# EAGLE design control_rev4 (EAGLE 5.06)
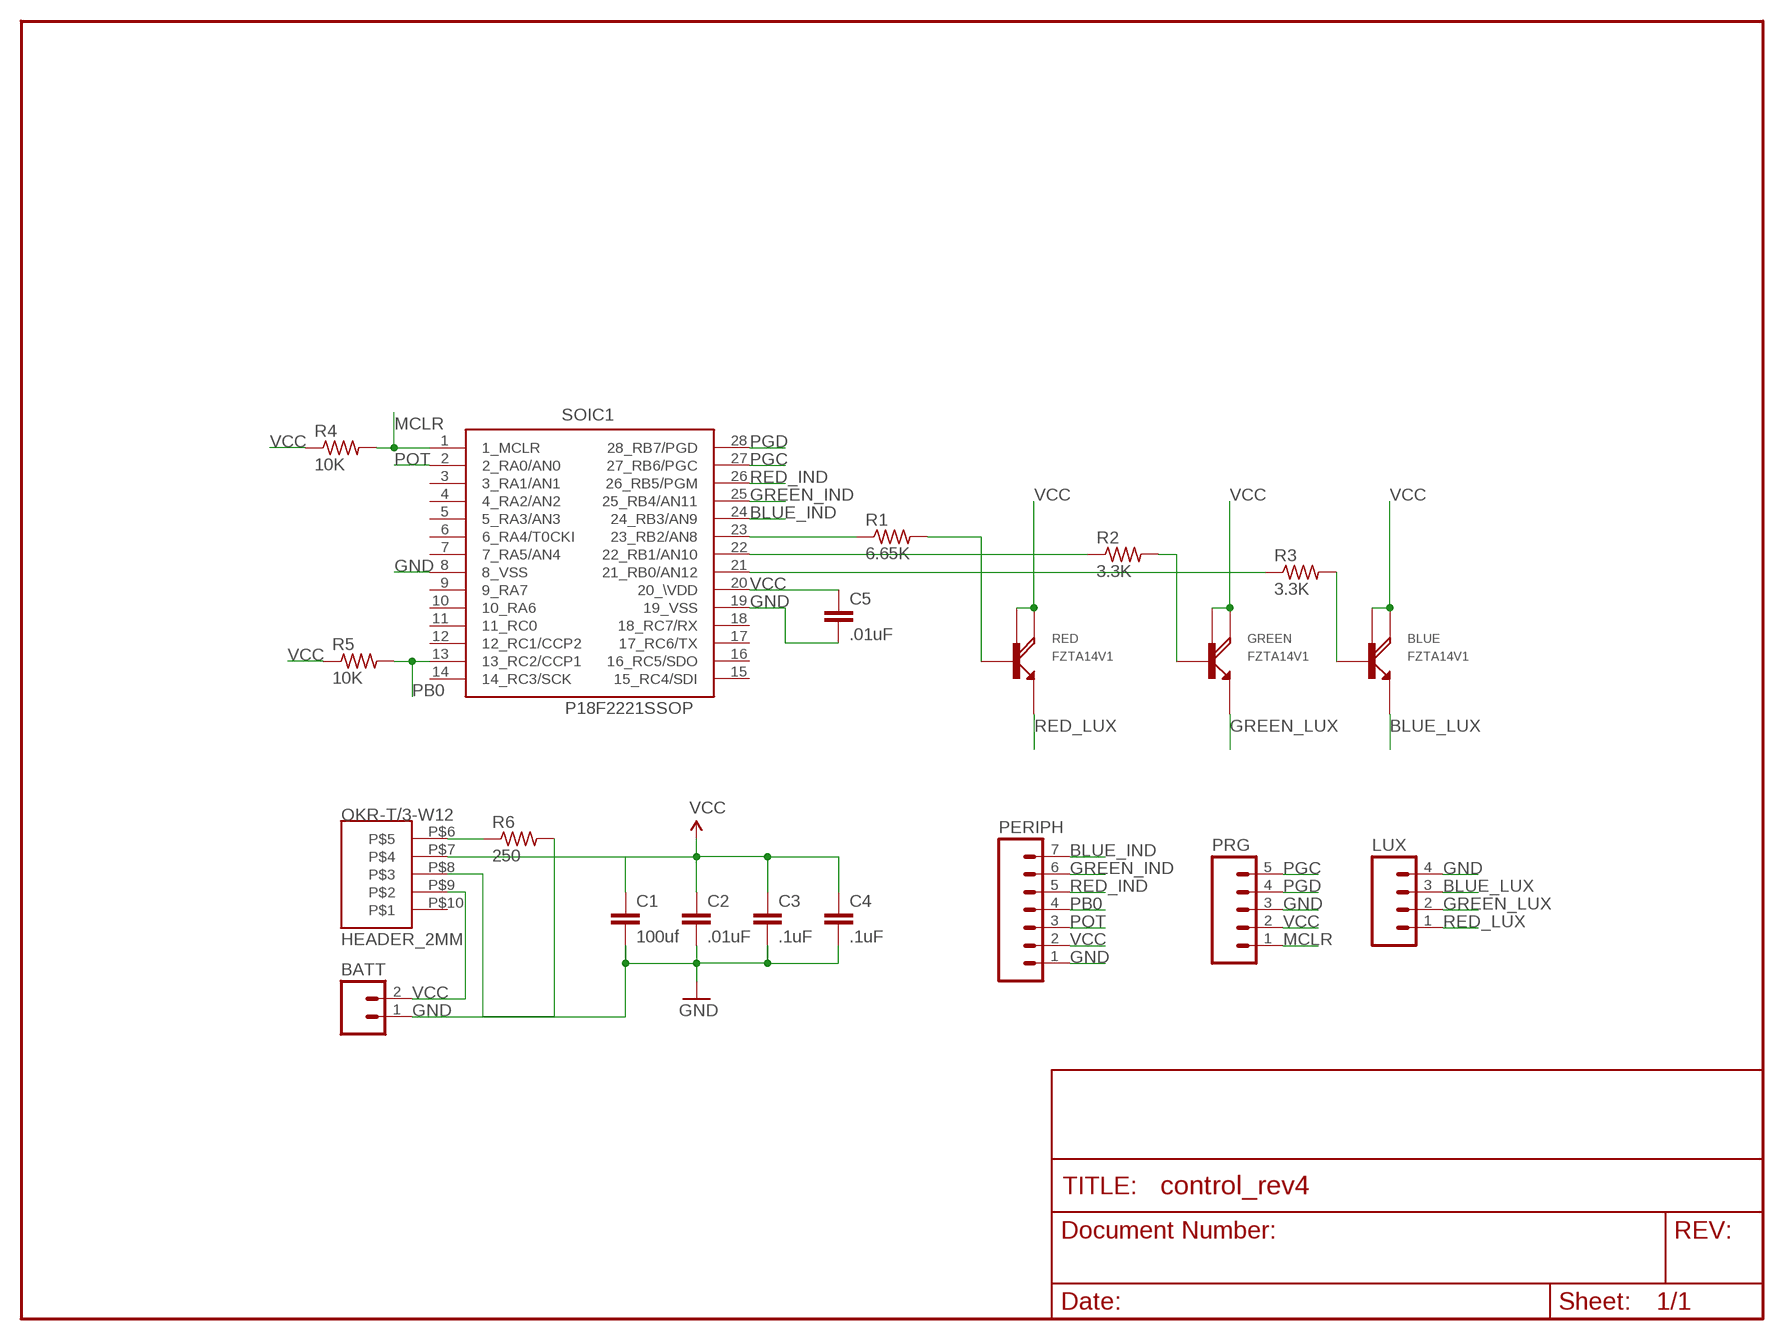
[diagram p0: schematic, sheet 1]

## Parts
BATT  M02PTH  [1X02]
BLUE  FZTA14V1  [SOT223]
C1  100uf  C5/7.2  [C5B7.2]
C2  .01uF  CAP0805  [0805]
C3  .1uF  CAP0805  [0805]
C4  .1uF  CAP0805  [0805]
C5  .01uF  CAP0805  [0805]
GREEN  FZTA14V1  [SOT223]
LUX  M04PTH  [1X04]
OKR-T/3-W12  HEADER_2MM  [HEADER2MM_5]
PERIPH  M07  [1X07]
PRG  M05PTH  [1X05]
R1  6.65K  R-US_M1206  [M1206]
R2  3.3K  R-US_M1206  [M1206]
R3  3.3K  R-US_M1206  [M1206]
R4  10K  R-US_M1206  [M1206]
R5  10K  R-US_M1206  [M1206]
R6  250  R-US_M1206  [M1206]
RED  FZTA14V1  [SOT223]
SOIC1  P18F2221SSOP  [SSOP-28]

## Nets
BLUE_IND: PERIPH.7 SOIC1.24(24_RB3/AN9)
BLUE_LUX: BLUE.EMIT(E) LUX.3
GND: BATT.1 C1.2 C2.2 C3.2 C4.2 C5.2 LUX.4 OKR-T/3-W12.P$8 PERIPH.1 PRG.3 R6.2 SOIC1.8(8_VSS) SOIC1.19(19_VSS)
GREEN_IND: PERIPH.6 SOIC1.25(25_RB4/AN11)
GREEN_LUX: GREEN.EMIT(E) LUX.2
MCLR: PRG.1 R4.2 SOIC1.1(1_MCLR)
N$4: R1.1 SOIC1.23(23_RB2/AN8)
N$5: R1.2 RED.BASE(B)
N$6: R2.1 SOIC1.22(22_RB1/AN10)
N$7: GREEN.BASE(B) R2.2
N$8: R3.1 SOIC1.21(21_RB0/AN12)
N$9: BLUE.BASE(B) R3.2
N$19: OKR-T/3-W12.P$6 R6.1
PB0: PERIPH.4 R5.2 SOIC1.13(13_RC2/CCP1)
PGC: PRG.5 SOIC1.27(27_RB6/PGC)
PGD: PRG.4 SOIC1.28(28_RB7/PGD)
POT: PERIPH.3 SOIC1.2(2_RA0/AN0)
PWR: BATT.2 OKR-T/3-W12.P$9
RED_IND: PERIPH.5 SOIC1.26(26_RB5/PGM)
RED_LUX: LUX.1 RED.EMIT(E)
VCC: BLUE.COLL(C) BLUE.HEAT(C2) C1.1 C2.1 C3.1 C4.1 C5.1 GREEN.COLL(C) GREEN.HEAT(C2) OKR-T/3-W12.P$7 PERIPH.2 PRG.2 R4.1 R5.1 RED.COLL(C) RED.HEAT(C2) SOIC1.20(20_\VDD)
Unconnected: OKR-T/3-W12.P$10 SOIC1.3(3_RA1/AN1) SOIC1.4(4_RA2/AN2) SOIC1.5(5_RA3/AN3) SOIC1.6(6_RA4/T0CKI) SOIC1.7(7_RA5/AN4) SOIC1.9(9_RA7) SOIC1.10(10_RA6) SOIC1.11(11_RC0) SOIC1.12(12_RC1/CCP2) SOIC1.14(14_RC3/SCK) SOIC1.15(15_RC4/SDI) SOIC1.16(16_RC5/SDO) SOIC1.17(17_RC6/TX) SOIC1.18(18_RC7/RX)

## Library data of the parts
BATT = SparkFun:M02: Header 2 Standard 2-pin 0.1" header. Use with straight break away headers (SKU : PRT-00116), right angle break away headers (PRT-00553), swiss pins (PRT-00743), machine pins (PRT-00117), and female headers (PRT-00115). Molex polarized connector foot print use with SKU : PRT-08233 with associated crimp pins and housings.
BLUE GREEN RED = purduecer:FZTA14: NPN Darlington Transistor
C1 = capacitor-wima:C: CAPACITOR naming: grid - package width
C2-C5 = SparkFun:CAP: Capacitor Standard 0603 ceramic capacitor, and 0.1" leaded capacitor.
LUX = SparkFun:M04: Header 4 Standard 4-pin 0.1" header. Use with straight break away headers (SKU : PRT-00116), right angle break away headers (PRT-00553), swiss pins (PRT-00743), machine pins (PRT-00117), and female headers (PRT-00115). Molex polarized connector foot print use with SKU : PRT-08231 with associated crimp pins and housings.
OKR-T/3-W12 = NBitWonder:HEADER_2MM: 5-pin Header w/ 2mm (NOT 2.54mm!) spacing
PERIPH = SparkFun:M07: Header 7 Standard 7-pin 0.1" header. Use with straight break away headers (SKU : PRT-00116), right angle break away headers (PRT-00553), swiss pins (PRT-00743), machine pins (PRT-00117), and female headers (PRT-00115). NOTES ON THE VARIANTS LOCK and LOCK_LONGPADS... This footprint was designed to help hold the alignment of a through-hole component (i.e. 7-pin header) while soldering it into place. You may notice that each hole has been shifted either up or down by 0.005 of an inch from it's more standard position (which is usually a perfectly straight line). This slight alteration caused the pins (the squares in the middle) to touch the edges of the holes. Because they are alternating, it causes a "brace" to hold the header in place. 0.005 has proven to be the perfect amount of "off-center" position when using our standard breakaway headers. Although looks a little odd when you look at the bare footprint, once you have a header in there, the alteration is very hard to notice. Also, if you push a header all the way into place, it is covered up entirely on the bottom side. This idea of altering the position of holes to aid alignment will be further integrated into the Sparkfun Library for other footprints. It can help hold any component with 3 or more connection pins.
PRG = SparkFun:M05: Header 5 Standard 5-pin 0.1" header. Use with straight break away headers (SKU : PRT-00116), right angle break away headers (PRT-00553), swiss pins (PRT-00743), machine pins (PRT-00117), and female headers (PRT-00115). Molex polarized connector foot print use with SKU : PRT-08230 with associated crimp pins and housings.
R1-R6 = resistor:R-US_: RESISTOR, American symbol
SOIC1 = purduecer:P18F2221: 28-pin PIC18F series Microcontroller

## Board
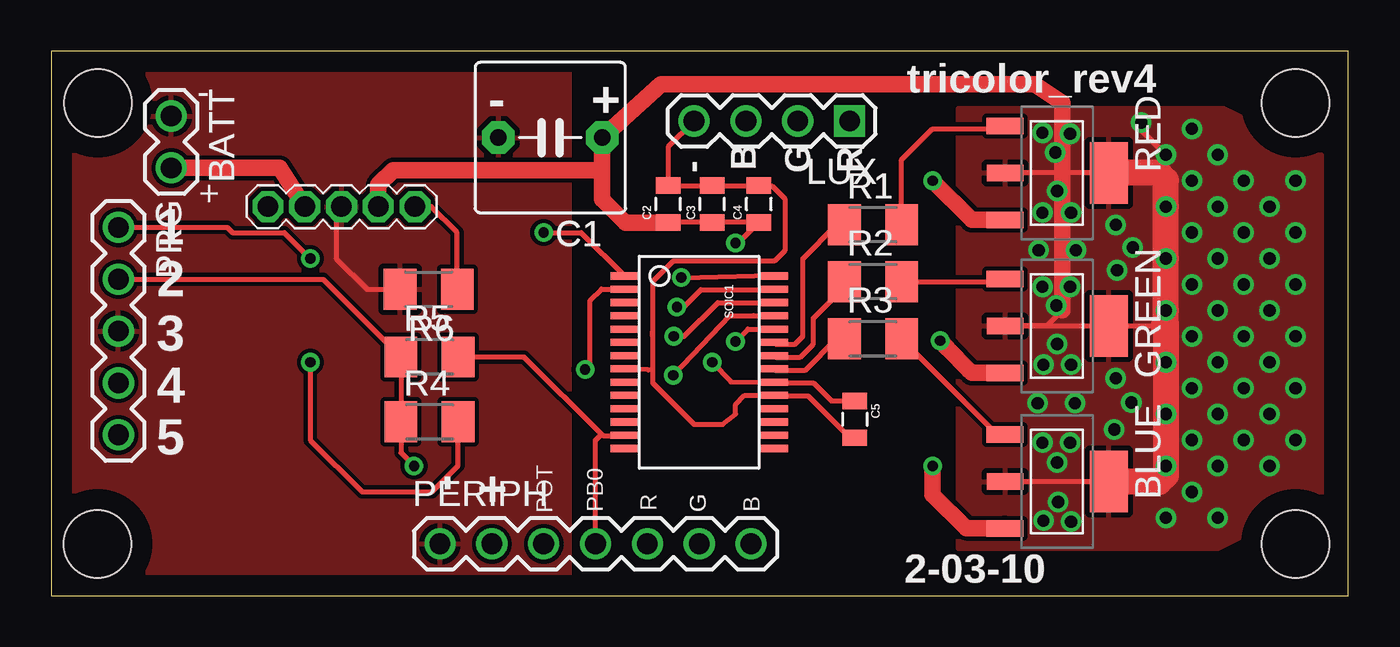
[diagram p1: board, top side]
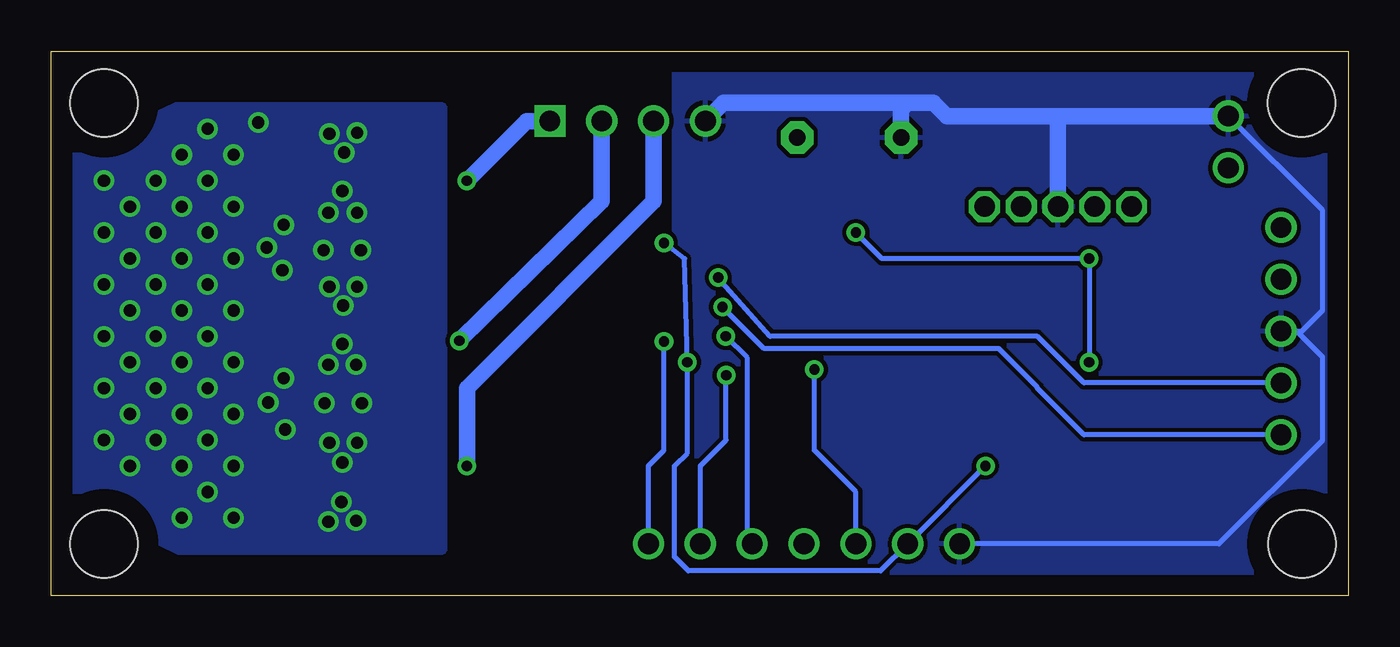
[diagram p2: board, bottom side, seen from below]

Size 63.55 x 26.67 mm. Coordinates in mm from the lower left corner, seen from the top.
Outline: 0,0 63.55,0 63.55,26.66 0,26.67 0,0
Copper layers (1*16): Top 0.035mm / dielectric 1.5mm / Bottom 0.035mm
Design rules "default": minimum track width 10mil, minimum drill 24mil, track to track 8mil, track to pad 8mil, pad to pad 8mil, via to via 8mil, smd to smd 8mil, copper to edge 40mil, drill to drill 8mil, minimum pad ring 10mil, minimum via ring 8mil, stop-mask expansion 4mil, vias tented up to drill 0mil, thermal gap 10mil

### Footprints (pad centres in the part's own frame; a part is rotated, then mirrored left to right if it is on the bottom)
1X02 = drill 1.016 round: 1 0,0; 2 2.54,0
SOT223 = smd 0.8 x 1.8: BASE -2.3,-2.55; COLL 0,-2.54; EMIT 2.3,-2.55 | smd 3 x 1.85: HEAT 0,2.54
C5B7.2 = drill 0.813 pad 1.6 octagon: 1 -2.54,0; 2 2.54,0
0805 = smd 0.8 x 1.2: 1 -0.9,0; 2 0.9,0
1X04 = drill 1.016 square: 1 0,0 | drill 1.016 round: 2 2.54,0; 3 5.08,0; 4 7.62,0
HEADER2MM_5 = drill 1 octagon: P$6 0,0; P$7 1.8,0; P$8 3.6,0; P$9 5.4,0; P$10 7.2,0
1X07 = drill 1.016 round: 1 0,0; 2 2.54,0; 3 5.08,0; 4 7.62,0; 5 10.16,0; 6 12.7,0; 7 15.24,0
1X05 = drill 1.016 round: 1 0,0; 2 2.54,0; 3 5.08,0; 4 7.62,0; 5 10.16,0
M1206 = smd 1.6 x 2: 1 -1.4,0; 2 1.4,0
SSOP-28 = smd 0.348 x 1.397: 1 -4.225,-3.656; 2 -3.575,-3.656; 3 -2.925,-3.656; 4 -2.275,-3.656; 5 -1.625,-3.656; 6 -0.975,-3.656; 7 -0.325,-3.656; 8 0.325,-3.656; 9 0.975,-3.656; 10 1.625,-3.656; 11 2.275,-3.656; 12 2.925,-3.656; 13 3.575,-3.656; 14 4.225,-3.656; 15 4.225,3.656; 16 3.575,3.656; 17 2.925,3.656; 18 2.275,3.656; 19 1.625,3.656; 20 0.975,3.656; 21 0.325,3.656; 22 -0.325,3.656; 23 -0.975,3.656; 24 -1.625,3.656; 25 -2.275,3.656; 26 -2.925,3.656; 27 -3.575,3.656; 28 -4.225,3.656
STAND-OFF = hole 3.302: 0,0

### Placement (x,y rotation side)
BATT  5.89,23.49 270 top
BLUE  49.28,5.59 270 top
C1  24.46,22.43 180 top
C2  30.23,19.18 90 top
C3  32.38,19.18 90 top
C4  34.67,19.18 90 top
C5  39.37,8.64 270 top
GREEN  49.28,13.21 270 top
LUX  39.12,23.24 180 top
OKR-T/3-W12  17.83,19.05 180 top
PERIPH  19.05,2.54 0 top
PRG  3.3,18.04 270 top
R1  40.26,18.16 0 top
R2  40.26,15.37 0 top
R3  40.26,12.57 0 top
R4  18.54,8.51 0 top
R5  18.54,11.68 0 top
R6  18.49,15 180 top
RED  49.28,20.7 270 top
SOIC1  31.75,11.43 270 top
U$1  [STAND-OFF]  2.29,2.54 0 top
U$2  [STAND-OFF]  2.29,24.13 0 top
U$3  [STAND-OFF]  60.96,24.13 0 top
U$4  [STAND-OFF]  60.96,2.54 0 top

### Tracks (layer width: path | path; a pad name or v marks a point on that pad's centre or on a via)
BLUE_IND  (via drill 0.51)
  Top 0.254: SOIC1.24 34.14,13.06 v33.53,12.45
  Bottom 0.254: v33.53,12.45 33.53,7.11 34.29,6.35 PERIPH.7
BLUE_LUX  (via drill 0.51)
  Top 0.813: v43.18,6.35 43.18,4.95 44.83,3.3 46.71,3.3 BLUE.EMIT
  Bottom 0.813: LUX.3 34.04,19.3 43.18,10.16 v43.18,6.35
GND
  Top 0.254: LUX.4 30.23,21.97 C2.2 C3.2 C4.2 34.68,20.07 35.31,20.07 35.94,19.43 35.94,16.89 35.43,16.38 31.11,16.38 31.11,16.39 30.47,16.39 29.46,15.38 29.46,12.7 | C5.2 39.13,7.74 37.08,9.78 35.43,9.78 SOIC1.19 33.98,9.81 33.53,9.36 33.53,8.89 32.89,8.38 31.5,8.38 29.46,10.41 29.46,11.05 | 29.46,11.05 29.25,11.06 SOIC1.8 | 29.46,12.7 29.46,11.05 | 29.46,12.7 29.46,12.96 | R6.2 15.48,15 13.97,16.51 13.97,18.91 OKR-T/3-W12.P$8
  Bottom 0.254: 2.54,12.96 2.29,12.96 1.27,13.97 1.27,18.87 BATT.1 | 2.54,12.96 PRG.3 | PERIPH.1 6.35,2.54 1.27,7.62 1.27,11.68 2.54,12.96
  Bottom 0.813: BATT.1 13.97,23.49 | 13.97,23.49 19.68,23.49 20.32,24.13 21.59,24.13 | 21.59,24.13 30.61,24.13 LUX.4 | C1.2 21.92,23.8 21.59,24.13 | OKR-T/3-W12.P$8 14.23,23.23 13.97,23.49
  pour Bottom: 33.02,0 33.02,26.67 0,26.67 0,0
  pour Top: 25.4,0 25.4,26.67 0,26.67 0,0
GREEN_IND  (via drill 0.51)
  Top 0.254: v30.48,10.8 33.26,13.7 34.42,13.72 SOIC1.25
  Bottom 0.254: v30.48,10.8 30.48,7.62 31.75,6.35 PERIPH.6
GREEN_LUX  (via drill 0.51)
  Top 0.813: v43.56,12.48 43.94,12.1 44.96,11.05 45.1,10.91 GREEN.EMIT
  Bottom 0.813: LUX.2 36.58,19.3 v43.56,12.48
MCLR  (via drill 0.5)
  Top 0.254: 28.08,15.66 27.94,15.66 27.95,15.66 SOIC1.1 25.97,17.78 v24.13,17.78 | PRG.1 8.64,18.04 8.89,17.78 11.43,17.78 v12.7,16.51 | v12.7,11.43 12.7,7.62 15.24,5.08 18.66,5.08 19.94,6.36 R4.2
  Bottom 0.254: v24.13,17.78 22.86,16.51 v12.7,16.51 v12.7,11.43
N$4
  Top 0.254: R1.1 38.48,18.16 36.83,16.51 36.83,12.7 36.45,12.32 35.49,12.32 SOIC1.23
N$5
  Top 0.254: R1.2 41.66,21.34 43.18,22.86 46.59,22.86 RED.BASE
N$6
  Top 0.254: R2.1 38.86,15.11 37.34,13.59 37.34,12.32 36.7,11.68 35.48,11.68 SOIC1.22
N$7
  Top 0.254: R2.2 46.59,15.37 GREEN.BASE
N$8
  Top 0.254: R3.1 38.48,12.57 36.96,11.05 35.46,11.05 SOIC1.21
N$9
  Top 0.254: BLUE.BASE 46.34,7.89 R3.2
N$19
  Top 0.254: OKR-T/3-W12.P$6 18.62,19.05 19.88,17.79 19.88,15.02 R6.1
PB0
  Top 0.254: R5.2 23.18,11.68 26.95,7.91 | 26.95,7.91 27.03,7.83 28.07,7.83 SOIC1.13 | PERIPH.4 26.67,7.62 26.95,7.91
PGC  (via drill 0.5)
  Top 0.254: v30.66,14.14 30.98,14.14 31.83,14.99 35.39,14.99 SOIC1.27
  Bottom 0.254: PRG.5 12.95,7.88 15.24,10.16 15.24,10.21 17.13,12.1 28.62,12.1 v30.66,14.14
PGD  (via drill 0.5)
  Top 0.254: v30.87,15.58 35.37,15.69 SOIC1.28
  Bottom 0.254: PRG.4 12.95,10.41 15.24,12.7 28.33,12.7 v30.87,15.58
POT  (via drill 0.5)
  Top 0.254: SOIC1.2 26.95,15.01 26.41,14.46 26.41,11.33 v26.16,11.08
  Bottom 0.254: v26.16,11.08 26.16,7.12 24.13,5.08 PERIPH.3
PWR
  Top 0.813: BATT.2 11.2,20.95 OKR-T/3-W12.P$9
RED_IND  (via drill 0.51)
  Top 0.254: SOIC1.26 32.66,14.36 30.99,12.69 30.52,12.69 v30.5,12.71
  Bottom 0.254: v30.5,12.71 | v30.5,12.71 29.45,11.65 29.45,2.78 PERIPH.5
RED_LUX  (via drill 0.51)
  Top 0.813: RED.EMIT 45.1,18.4 v43.18,20.32
  Bottom 0.813: v43.18,20.32 40.27,23.23 39.13,23.23 LUX.1
VCC  (via drill 0.5, 0.51, 0.6)
  Top 0.254: GREEN.COLL GREEN.HEAT | BLUE.HEAT BLUE.COLL | C5.1 38.22,9.54 37.34,10.41 35.45,10.41 SOIC1.20 33.3,10.47 v32.38,11.43 | RED.HEAT RED.COLL | GREEN.COLL 54.5,13.21 | PRG.2 13.33,15.49 R5.1 R4.1 17.14,6.99 v17.78,6.35 | C2.1 C3.1 C4.1 33.67,17.27 v33.53,17.27 | GREEN.COLL 48.77,13.21 49.53,13.97 | v53.4,23.17 53.4,22.8 v54.61,21.59
  Top 0.813: 49.53,13.97 49.53,24.13 48.17,25.05 29.88,25.05 C1.1 27,20.82 | 27,20.82 27,19.4 28.13,18.27 30.21,18.27 C2.1 | OKR-T/3-W12.P$7 16.03,20.11 16.76,20.84 26.98,20.84 27,20.82
  Top 1.27: RED.HEAT 54.23,20.7 54.61,20.32 v54.61,19.05 v54.61,16.51 v54.61,13.97 54.61,13.32 | 54.61,13.32 v54.61,11.43 v54.61,8.89 v54.61,6.35 54.61,5.91 54.27,5.57 51.83,5.57 BLUE.HEAT | 54.5,13.21 54.61,13.32
  Bottom 0.254: v33.53,17.27 32.51,16.51 v32.38,11.43 32.38,6.99 33.02,6.35 33.02,1.9 32.33,1.22 22.91,1.22 PERIPH.2 v17.78,6.35
  other vias: 54.61,3.81 57.15,3.81 55.88,5.08 57.15,6.35 55.88,7.62 59.69,6.35 58.42,7.62 60.96,7.62 59.69,8.89 57.15,8.89 55.88,10.16 58.42,10.16 60.96,10.16 59.69,11.43 57.15,11.43 55.88,12.7 58.42,12.7 60.96,12.7 59.69,13.97 57.15,13.97 55.88,15.24 58.42,15.24 60.96,15.24 59.69,16.51 57.15,16.51 55.88,17.78 60.96,17.78 58.42,17.78 57.15,19.05 55.88,20.32 59.69,19.05 58.42,20.32 60.96,20.32 57.15,21.59 55.88,22.86 48.61,3.67 49.96,3.63 49.33,4.59 49.29,6.53 48.56,7.49 49.91,7.49 52.08,8.14 52.92,9.46 52.15,10.65 50.15,9.42 48.32,9.42 49.96,11.31 48.61,11.31 49.29,12.32 49.24,14.21 48.56,15.13 49.91,15.13 50.2,16.92 48.37,16.92 52.22,15.93 52.98,17.05 52.15,18.16 49.96,18.75 48.56,18.75 49.29,19.82 49.19,21.7 48.56,22.67 49.91,22.62
  pour Top: 44.45,2.29 44.45,23.88 57.41,23.88 62.23,21.57 62.23,4.83 57.15,2.29
  pour Bottom: 44.45,23.88 57.4,23.88 62.23,21.59 62.23,4.7 57.28,2.29 44.45,2.29

### Text on the board
tPlace: tricolor_rev4 | - | - | + | - | B | G | R | + | 1 | 2 | 3 | 4 | 5 | - | + | POT | PB0 | R | G | G | B | 2-03-10
_tNames: BATT | BATT | RED | RED | LUX | LUX | PRG | PRG | R1 | R1 | C1 | C1 | C2 | C2 | C3 | C3 | C4 | C4 | R2 | R2 | GREEN | GREEN | SOIC1 | SOIC1 | R6 | R6 | R3 | R3 | R5 | R5 | R4 | R4 | C5 | C5 | BLUE | BLUE | PERIPH | PERIPH